# EAGLE schematic uOsc_2 board_2_v2.0 (EAGLE 9.2.1)

## Sheet 1 of 5
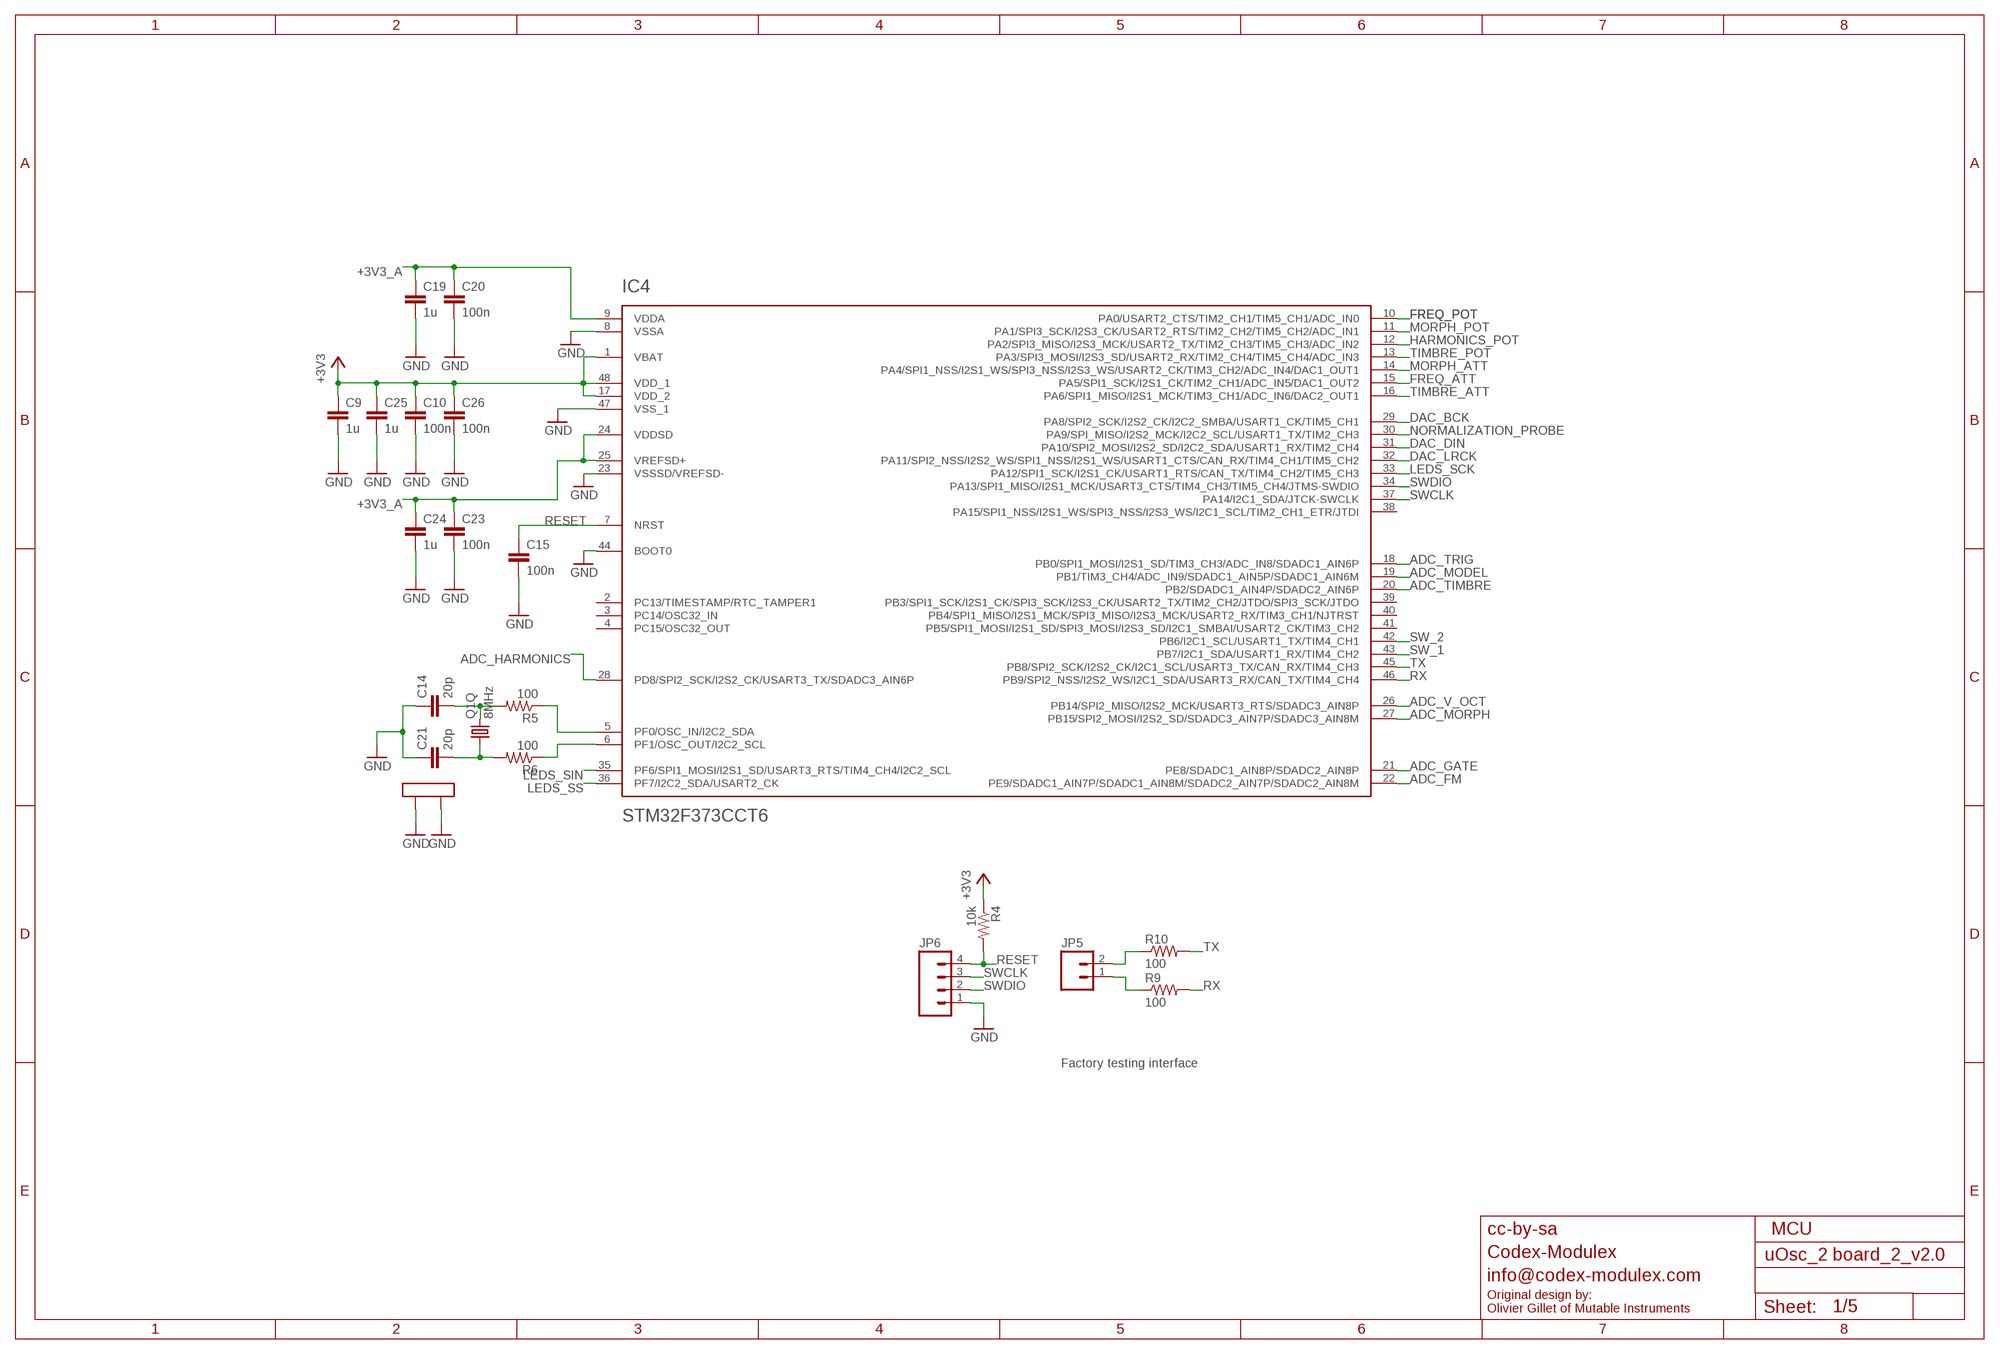
[diagram p0: schematic, sheet 1]

### Parts
C9  1u  PARTS_AMAN_CAPACITOR  [PARTS_AMAN_RESISTOR_0603]
C10  100n  PARTS_AMAN_CAPACITOR  [PARTS_AMAN_RESISTOR_0603]
C14  20p  PARTS_AMAN_CAPACITOR  [PARTS_AMAN_RESISTOR_0603]
C15  100n  PARTS_AMAN_CAPACITOR  [PARTS_AMAN_RESISTOR_0603]
C19  1u  PARTS_AMAN_CAPACITOR  [PARTS_AMAN_RESISTOR_0603]
C20  100n  PARTS_AMAN_CAPACITOR  [PARTS_AMAN_RESISTOR_0603]
C21  20p  PARTS_AMAN_CAPACITOR  [PARTS_AMAN_RESISTOR_0603]
C23  100n  PARTS_AMAN_CAPACITOR  [PARTS_AMAN_RESISTOR_0603]
C24  1u  PARTS_AMAN_CAPACITOR  [PARTS_AMAN_RESISTOR_0603]
C25  1u  PARTS_AMAN_CAPACITOR  [PARTS_AMAN_RESISTOR_0603]
C26  100n  PARTS_AMAN_CAPACITOR  [PARTS_AMAN_RESISTOR_0603]
IC4  STM32F373CCT6  STM32F373C  [LQFP48]
JP5  M02PTH  [1X02]
JP6  M04PTH  [1X04]
Q1  8MHz  CRYSTAL  [CTS406]
R4  10k  PARTS_AMAN_RESISTOR  [PARTS_AMAN_RESISTOR_0603]
R5  100  PARTS_AMAN_RESISTOR  [PARTS_AMAN_RESISTOR_0603]
R6  100  PARTS_AMAN_RESISTOR  [PARTS_AMAN_RESISTOR_0603]
R9  100  PARTS_AMAN_RESISTOR  [PARTS_AMAN_RESISTOR_0603]
R10  100  PARTS_AMAN_RESISTOR  [PARTS_AMAN_RESISTOR_0603]

### Nets
+3V3: C9.1 C10.1 C25.1 C26.1 IC4.1(VBAT) IC4.17(VDD_2) IC4.48(VDD_1) R4.1 ; also sheet 2,3,4,5
+3V3_A: C19.1 C20.1 C23.1 C24.1 IC4.9(VDDA) IC4.24(VDDSD) IC4.25(VREFSD+) ; also sheet 2,3,4,5
ADC_FM: IC4.22(PE9/SDADC1_AIN7P/SDADC1_AIN8M/SDADC2_AIN7P/SDADC2_AIN8M) ; also sheet 3
ADC_GATE: IC4.21(PE8/SDADC1_AIN8P/SDADC2_AIN8P) ; also sheet 3
ADC_HARMONICS: IC4.28(PD8/SPI2_SCK/I2S2_CK/USART3_TX/SDADC3_AIN6P) ; also sheet 3
ADC_MODEL: IC4.19(PB1/TIM3_CH4/ADC_IN9/SDADC1_AIN5P/SDADC1_AIN6M) ; also sheet 3
ADC_MORPH: IC4.27(PB15/SPI2_MOSI/I2S2_SD/SDADC3_AIN7P/SDADC3_AIN8M) ; also sheet 3
ADC_TIMBRE: IC4.20(PB2/SDADC1_AIN4P/SDADC2_AIN6P) ; also sheet 3
ADC_TRIG: IC4.18(PB0/SPI1_MOSI/I2S1_SD/TIM3_CH3/ADC_IN8/SDADC1_AIN6P) ; also sheet 3
ADC_V_OCT: IC4.26(PB14/SPI2_MISO/I2S2_MCK/USART3_RTS/SDADC3_AIN8P) ; also sheet 3
DAC_BCK: IC4.29(PA8/SPI2_SCK/I2S2_CK/I2C2_SMBA/USART1_CK/TIM5_CH1) ; also sheet 4
DAC_DIN: IC4.31(PA10/SPI2_MOSI/I2S2_SD/I2C2_SDA/USART1_RX/TIM2_CH4) ; also sheet 4
DAC_LRCK: IC4.32(PA11/SPI2_NSS/I2S2_WS/SPI1_NSS/I2S1_WS/USART1_CTS/CAN_RX/TIM4_CH1/TIM5_CH2) ; also sheet 4
FREQ_ATT: IC4.15(PA5/SPI1_SCK/I2S1_CK/TIM2_CH1/ADC_IN5/DAC1_OUT2) ; also sheet 2
FREQ_POT: IC4.10(PA0/USART2_CTS/TIM2_CH1/TIM5_CH1/ADC_IN0) ; also sheet 2
GND: C9.2 C10.2 C14.1 C15.2 C19.2 C20.2 C21.1 C23.2 C24.2 C25.2 C26.2 IC4.8(VSSA) IC4.23(VSSSD/VREFSD-) IC4.44(BOOT0) IC4.47(VSS_1) JP6.1 Q1.2(LID1) Q1.4(LID2) ; also sheet 2,3,4,5
HARMONICS_POT: IC4.12(PA2/SPI3_MISO/I2S3_MCK/USART2_TX/TIM2_CH3/TIM5_CH3/ADC_IN2) ; also sheet 2
LEDS_SCK: IC4.33(PA12/SPI1_SCK/I2S1_CK/USART1_RTS/CAN_TX/TIM4_CH2/TIM5_CH3) ; also sheet 2
LEDS_SIN: IC4.35(PF6/SPI1_MOSI/I2S1_SD/USART3_RTS/TIM4_CH4/I2C2_SCL) ; also sheet 2
LEDS_SS: IC4.36(PF7/I2C2_SDA/USART2_CK) ; also sheet 2
MORPH_ATT: IC4.14(PA4/SPI1_NSS/I2S1_WS/SPI3_NSS/I2S3_WS/USART2_CK/TIM3_CH2/ADC_IN4/DAC1_OUT1) ; also sheet 2
MORPH_POT: IC4.11(PA1/SPI3_SCK/I2S3_CK/USART2_RTS/TIM2_CH2/TIM5_CH2/ADC_IN1) ; also sheet 2
N$7: IC4.5(PF0/OSC_IN/I2C2_SDA) R5.1
N$8: IC4.6(PF1/OSC_OUT/I2C2_SCL) R6.1
N$29: C14.2 Q1.3 R5.2
N$33: JP5.2 R10.1
N$35: C21.2 Q1.1 R6.2
N$51: JP5.1 R9.1
NORMALIZATION_PROBE: IC4.30(PA9/SPI_MISO/I2S2_MCK/I2C2_SCL/USART1_TX/TIM2_CH3) ; also sheet 3
RESET: C15.1 IC4.7(NRST) JP6.4 R4.2
RX: IC4.46(PB9/SPI2_NSS/I2S2_WS/I2C1_SDA/USART3_RX/CAN_TX/TIM4_CH4) R9.2
SW_1: IC4.43(PB7/I2C1_SDA/USART1_RX/TIM4_CH2) ; also sheet 2
SW_2: IC4.42(PB6/I2C1_SCL/USART1_TX/TIM4_CH1) ; also sheet 2
SWCLK: IC4.37(PA14/I2C1_SDA/JTCK-SWCLK) JP6.3
SWDIO: IC4.34(PA13/SPI1_MISO/I2S1_MCK/USART3_CTS/TIM4_CH3/TIM5_CH4/JTMS-SWDIO) JP6.2
TIMBRE_ATT: IC4.16(PA6/SPI1_MISO/I2S1_MCK/TIM3_CH1/ADC_IN6/DAC2_OUT1) ; also sheet 2
TIMBRE_POT: IC4.13(PA3/SPI3_MOSI/I2S3_SD/USART2_RX/TIM2_CH4/TIM5_CH4/ADC_IN3) ; also sheet 2
TX: IC4.45(PB8/SPI2_SCK/I2S2_CK/I2C1_SCL/USART3_TX/CAN_RX/TIM4_CH3) R10.2
Unconnected: IC4.2(PC13/TIMESTAMP/RTC_TAMPER1) IC4.3(PC14/OSC32_IN) IC4.4(PC15/OSC32_OUT) IC4.38(PA15/SPI1_NSS/I2S1_WS/SPI3_NSS/I2S3_WS/I2C1_SCL/TIM2_CH1_ETR/JTDI) IC4.39(PB3/SPI1_SCK/I2S1_CK/SPI3_SCK/I2S3_CK/USART2_TX/TIM2_CH2/JTDO/SPI3_SCK/JTDO) IC4.40(PB4/SPI1_MISO/I2S1_MCK/SPI3_MISO/I2S3_MCK/USART2_RX/TIM3_CH1/NJTRST) IC4.41(PB5/SPI1_MOSI/I2S1_SD/SPI3_MOSI/I2S3_SD/I2C1_SMBAI/USART2_CK/TIM3_CH2)

### Notes on the sheet
- Factory testing interface
- cc-by-sa | MCU
- Codex-Modulex
- info@codex-modulex.com
- Original design by:
  Olivier Gillet of Mutable Instruments

## Sheet 2 of 5
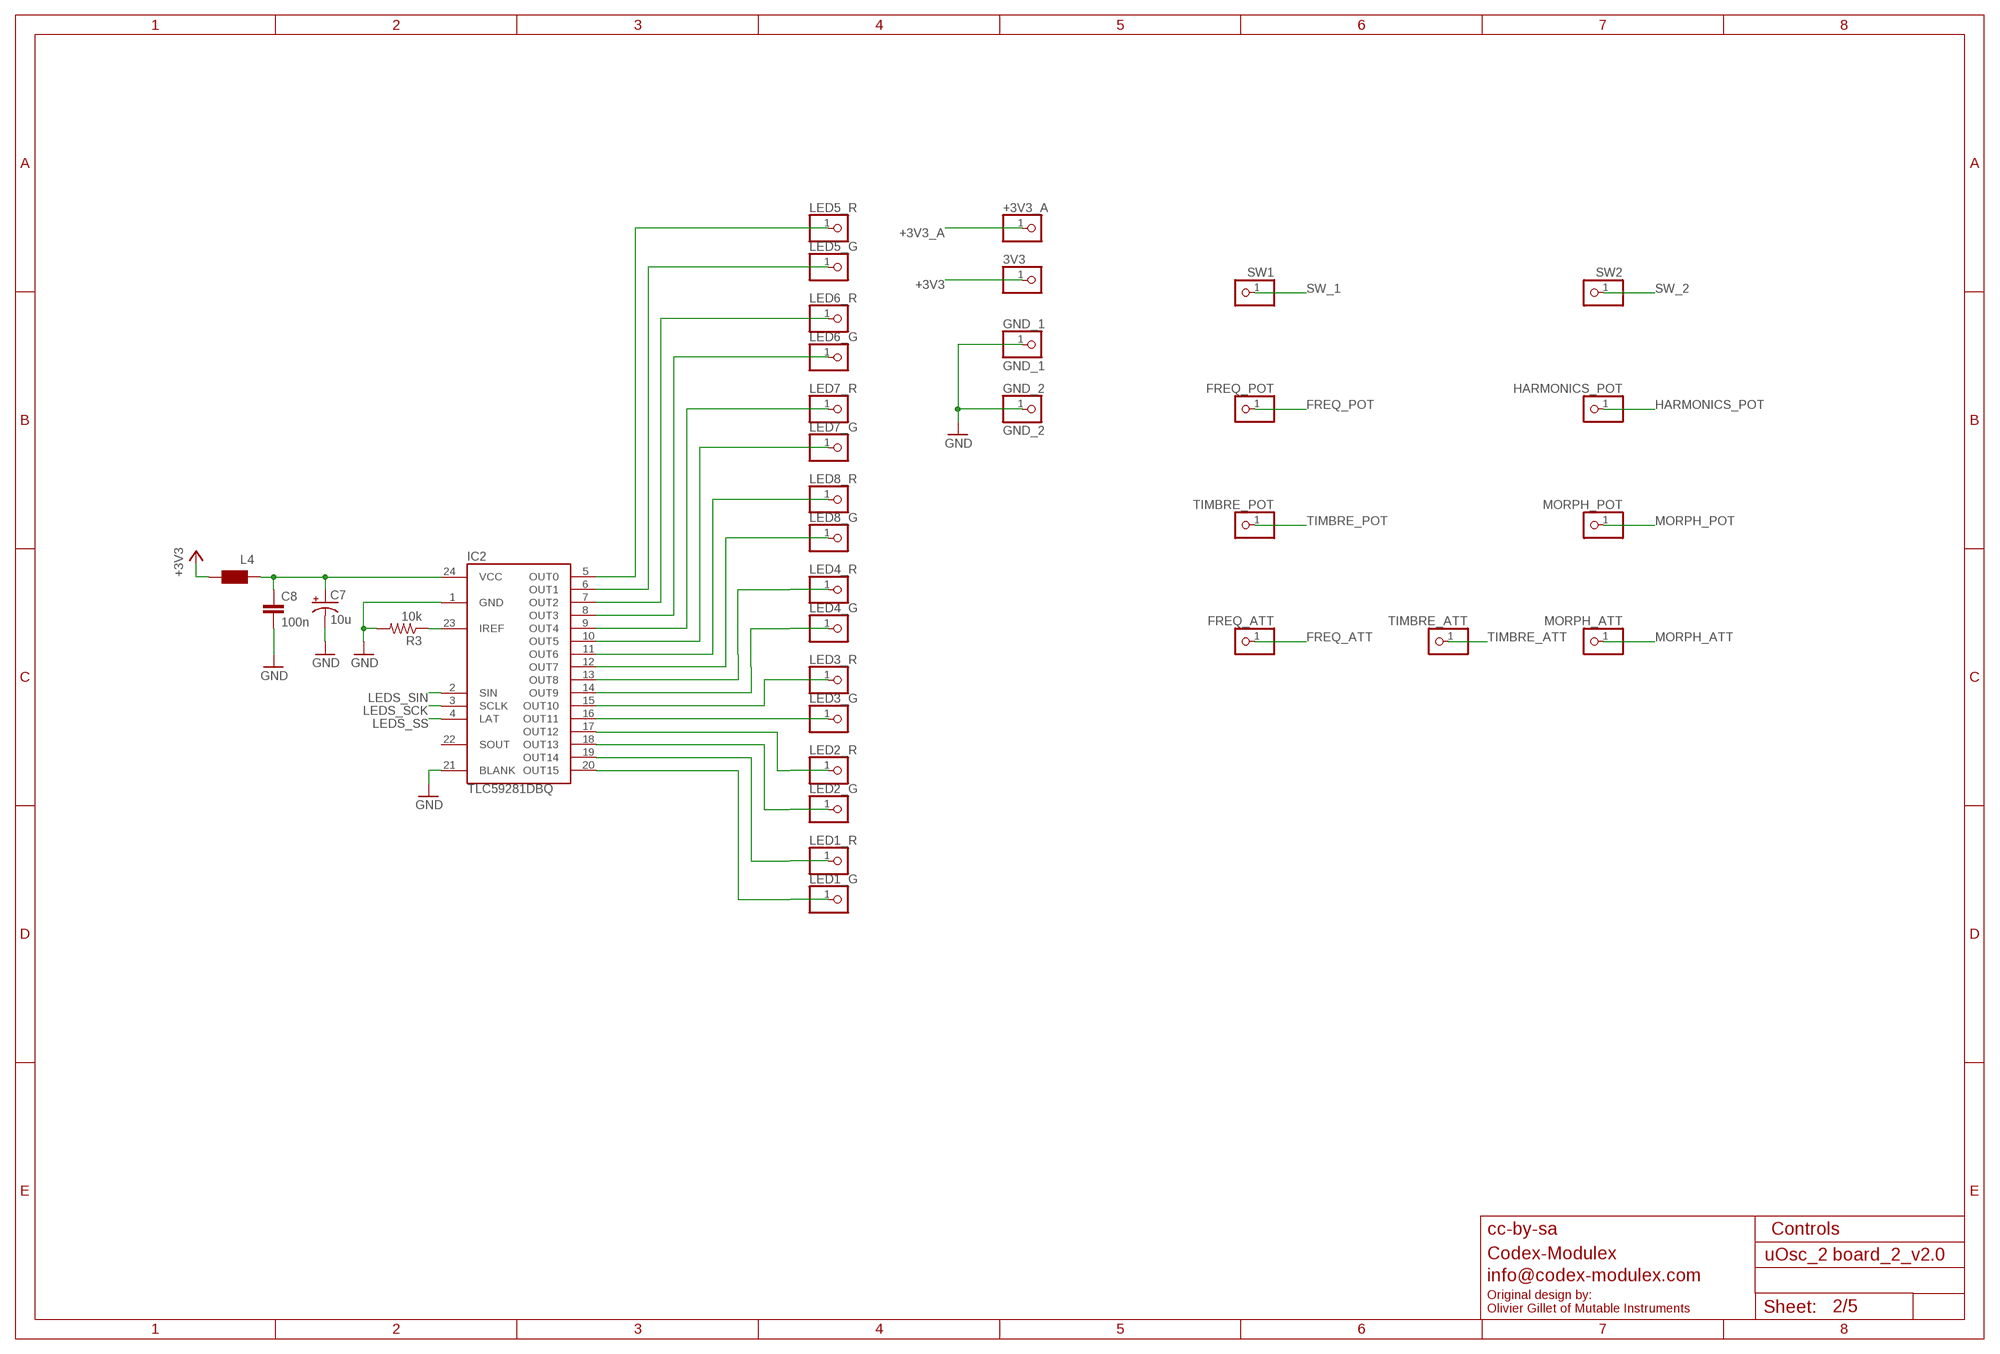
[diagram p1: schematic, sheet 2]

### Parts
3V3  PARTS_AMAN_PINHD-1X1  [PARTS_AMAN_1X01]
+3V3_A  PARTS_AMAN_PINHD-1X1  [PARTS_AMAN_1X01]
C7  10u  CPOL-USA  [PANASONIC_A]
C8  100n  PARTS_AMAN_CAPACITOR  [PARTS_AMAN_RESISTOR_0603]
FREQ_ATT  PARTS_AMAN_PINHD-1X1  [PARTS_AMAN_1X01]
FREQ_POT  PARTS_AMAN_PINHD-1X1  [PARTS_AMAN_1X01]
GND_1  GND_1  PARTS_AMAN_PINHD-1X1  [PARTS_AMAN_1X01]
GND_2  GND_2  PARTS_AMAN_PINHD-1X1  [PARTS_AMAN_1X01]
HARMONICS_POT  PARTS_AMAN_PINHD-1X1  [PARTS_AMAN_1X01]
IC2  TLC59281DBQ  [TSSOP24_0635]
L4  WE-CBF_0603  [0603]
LED1_G  PARTS_AMAN_PINHD-1X1  [PARTS_AMAN_1X01]
LED1_R  PARTS_AMAN_PINHD-1X1  [PARTS_AMAN_1X01]
LED2_G  PARTS_AMAN_PINHD-1X1  [PARTS_AMAN_1X01]
LED2_R  PARTS_AMAN_PINHD-1X1  [PARTS_AMAN_1X01]
LED3_G  PARTS_AMAN_PINHD-1X1  [PARTS_AMAN_1X01]
LED3_R  PARTS_AMAN_PINHD-1X1  [PARTS_AMAN_1X01]
LED4_G  PARTS_AMAN_PINHD-1X1  [PARTS_AMAN_1X01]
LED4_R  PARTS_AMAN_PINHD-1X1  [PARTS_AMAN_1X01]
LED5_G  PARTS_AMAN_PINHD-1X1  [PARTS_AMAN_1X01]
LED5_R  PARTS_AMAN_PINHD-1X1  [PARTS_AMAN_1X01]
LED6_G  PARTS_AMAN_PINHD-1X1  [PARTS_AMAN_1X01]
LED6_R  PARTS_AMAN_PINHD-1X1  [PARTS_AMAN_1X01]
LED7_G  PARTS_AMAN_PINHD-1X1  [PARTS_AMAN_1X01]
LED7_R  PARTS_AMAN_PINHD-1X1  [PARTS_AMAN_1X01]
LED8_G  PARTS_AMAN_PINHD-1X1  [PARTS_AMAN_1X01]
LED8_R  PARTS_AMAN_PINHD-1X1  [PARTS_AMAN_1X01]
MORPH_ATT  PARTS_AMAN_PINHD-1X1  [PARTS_AMAN_1X01]
MORPH_POT  PARTS_AMAN_PINHD-1X1  [PARTS_AMAN_1X01]
R3  10k  PARTS_AMAN_RESISTOR  [PARTS_AMAN_RESISTOR_0603]
SW1  PARTS_AMAN_PINHD-1X1  [PARTS_AMAN_1X01]
SW2  PARTS_AMAN_PINHD-1X1  [PARTS_AMAN_1X01]
TIMBRE_ATT  PARTS_AMAN_PINHD-1X1  [PARTS_AMAN_1X01]
TIMBRE_POT  PARTS_AMAN_PINHD-1X1  [PARTS_AMAN_1X01]

### Nets
+3V3: 3V3.1 L4.2 ; also sheet 1,3,4,5
+3V3_A: +3V3_A.1 ; also sheet 1,3,4,5
FREQ_ATT: FREQ_ATT.1 ; also sheet 1
FREQ_POT: FREQ_POT.1 ; also sheet 1
GND: C7.- C8.2 GND_1.1 GND_2.1 IC2.1(GND) IC2.21(BLANK) R3.2 ; also sheet 1,3,4,5
HARMONICS_POT: HARMONICS_POT.1 ; also sheet 1
LEDS_SCK: IC2.3(SCLK) ; also sheet 1
LEDS_SIN: IC2.2(SIN) ; also sheet 1
LEDS_SS: IC2.4(LAT) ; also sheet 1
MORPH_ATT: MORPH_ATT.1 ; also sheet 1
MORPH_POT: MORPH_POT.1 ; also sheet 1
N$2: IC2.12(OUT7) LED8_G.1
N$5: IC2.11(OUT6) LED8_R.1
N$9: IC2.10(OUT5) LED7_G.1
N$10: IC2.9(OUT4) LED7_R.1
N$11: IC2.8(OUT3) LED6_G.1
N$12: IC2.13(OUT8) LED4_R.1
N$13: IC2.7(OUT2) LED6_R.1
N$14: IC2.14(OUT9) LED4_G.1
N$15: IC2.6(OUT1) LED5_G.1
N$17: IC2.15(OUT10) LED3_R.1
N$18: IC2.16(OUT11) LED3_G.1
N$19: IC2.17(OUT12) LED2_R.1
N$20: IC2.18(OUT13) LED2_G.1
N$21: IC2.19(OUT14) LED1_R.1
N$22: IC2.5(OUT0) LED5_R.1
N$23: IC2.20(OUT15) LED1_G.1
N$27: C7.+ C8.1 IC2.24(VCC) L4.1
N$68: IC2.23(IREF) R3.1
SW_1: SW1.1 ; also sheet 1
SW_2: SW2.1 ; also sheet 1
TIMBRE_ATT: TIMBRE_ATT.1 ; also sheet 1
TIMBRE_POT: TIMBRE_POT.1 ; also sheet 1
Unconnected: IC2.22(SOUT)

### Notes on the sheet
- cc-by-sa | Controls
- Codex-Modulex
- info@codex-modulex.com
- Original design by:
  Olivier Gillet of Mutable Instruments

## Sheet 3 of 5
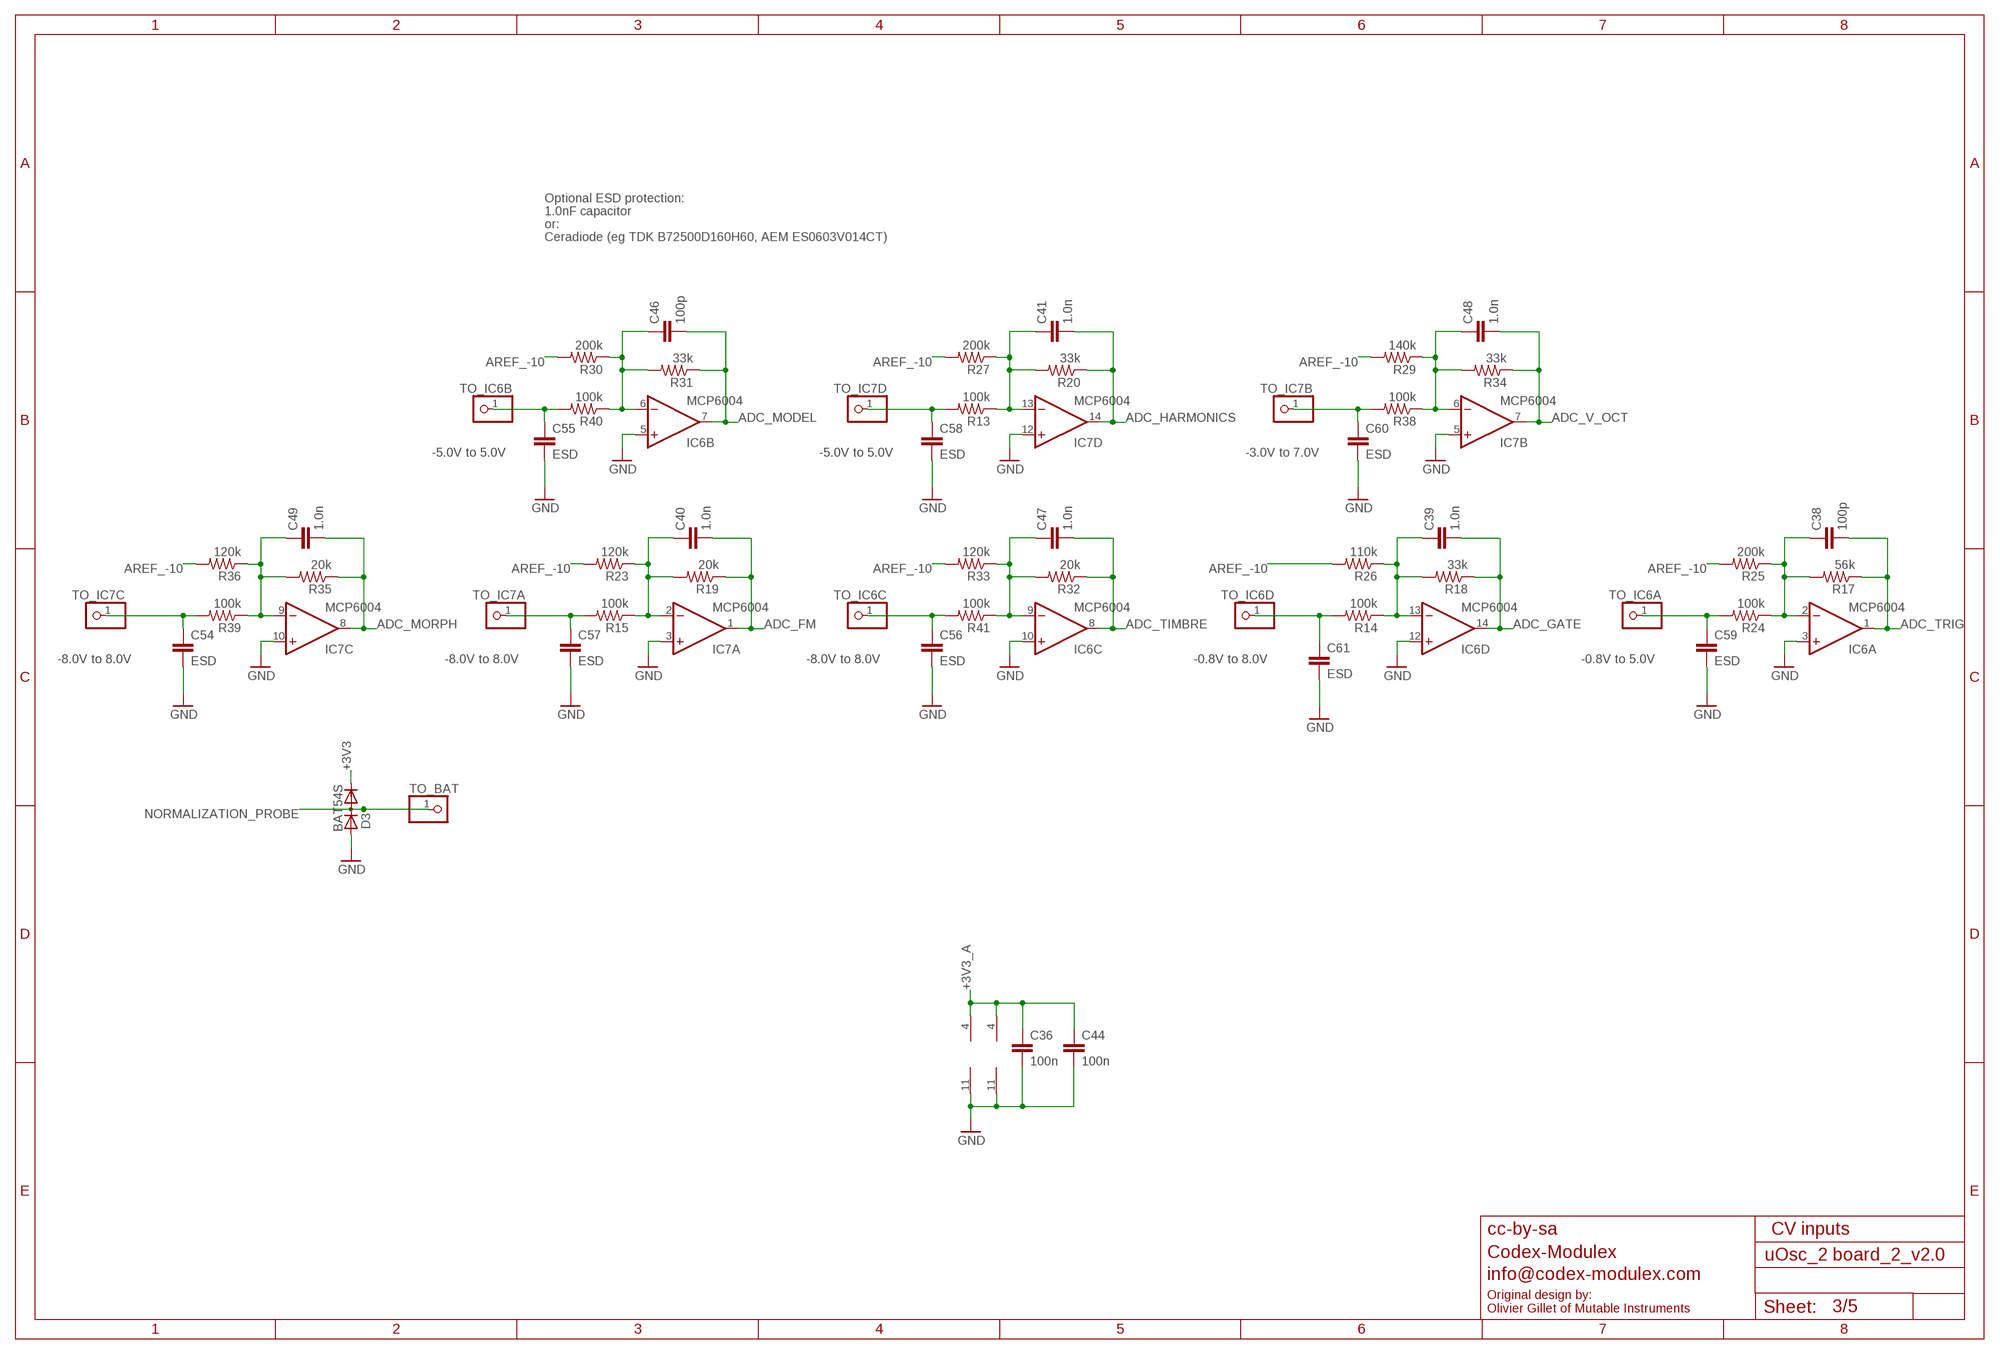
[diagram p2: schematic, sheet 3]

### Parts
C36  100n  PARTS_AMAN_CAPACITOR  [PARTS_AMAN_RESISTOR_0603]
C38  100p  PARTS_AMAN_CAPACITOR  [PARTS_AMAN_RESISTOR_0603]
C39  1.0n  PARTS_AMAN_CAPACITOR  [PARTS_AMAN_RESISTOR_0603]
C40  1.0n  PARTS_AMAN_CAPACITOR  [PARTS_AMAN_RESISTOR_0603]
C41  1.0n  PARTS_AMAN_CAPACITOR  [PARTS_AMAN_RESISTOR_0603]
C44  100n  PARTS_AMAN_CAPACITOR  [PARTS_AMAN_RESISTOR_0603]
C46  100p  PARTS_AMAN_CAPACITOR  [PARTS_AMAN_RESISTOR_0603]
C47  1.0n  PARTS_AMAN_CAPACITOR  [PARTS_AMAN_RESISTOR_0603]
C48  1.0n  PARTS_AMAN_CAPACITOR  [PARTS_AMAN_RESISTOR_0603]
C49  1.0n  PARTS_AMAN_CAPACITOR  [PARTS_AMAN_RESISTOR_0603]
C54  ESD  PARTS_AMAN_CAPACITOR  [PARTS_AMAN_RESISTOR_0603]
C55  ESD  PARTS_AMAN_CAPACITOR  [PARTS_AMAN_RESISTOR_0603]
C56  ESD  PARTS_AMAN_CAPACITOR  [PARTS_AMAN_RESISTOR_0603]
C57  ESD  PARTS_AMAN_CAPACITOR  [PARTS_AMAN_RESISTOR_0603]
C58  ESD  PARTS_AMAN_CAPACITOR  [PARTS_AMAN_RESISTOR_0603]
C59  ESD  PARTS_AMAN_CAPACITOR  [PARTS_AMAN_RESISTOR_0603]
C60  ESD  PARTS_AMAN_CAPACITOR  [PARTS_AMAN_RESISTOR_0603]
C61  ESD  PARTS_AMAN_CAPACITOR  [PARTS_AMAN_RESISTOR_0603]
D3  BAT54S  DIODE_2CACA-SOT23  [SOT23]
IC6  MCP6004  TL074PW  [TSSOP14_065]
IC7  MCP6004  TL074PW  [TSSOP14_065]
R13  100k  PARTS_AMAN_RESISTOR  [PARTS_AMAN_RESISTOR_0603]
R14  100k  PARTS_AMAN_RESISTOR  [PARTS_AMAN_RESISTOR_0603]
R15  100k  PARTS_AMAN_RESISTOR  [PARTS_AMAN_RESISTOR_0603]
R17  56k  PARTS_AMAN_RESISTOR  [PARTS_AMAN_RESISTOR_0603]
R18  33k  PARTS_AMAN_RESISTOR  [PARTS_AMAN_RESISTOR_0603]
R19  20k  PARTS_AMAN_RESISTOR  [PARTS_AMAN_RESISTOR_0603]
R20  33k  PARTS_AMAN_RESISTOR  [PARTS_AMAN_RESISTOR_0603]
R23  120k  PARTS_AMAN_RESISTOR  [PARTS_AMAN_RESISTOR_0603]
R24  100k  PARTS_AMAN_RESISTOR  [PARTS_AMAN_RESISTOR_0603]
R25  200k  PARTS_AMAN_RESISTOR  [PARTS_AMAN_RESISTOR_0603]
R26  110k  PARTS_AMAN_RESISTOR  [PARTS_AMAN_RESISTOR_0603]
R27  200k  PARTS_AMAN_RESISTOR  [PARTS_AMAN_RESISTOR_0603]
R29  140k  PARTS_AMAN_RESISTOR  [PARTS_AMAN_RESISTOR_0603]
R30  200k  PARTS_AMAN_RESISTOR  [PARTS_AMAN_RESISTOR_0603]
R31  33k  PARTS_AMAN_RESISTOR  [PARTS_AMAN_RESISTOR_0603]
R32  20k  PARTS_AMAN_RESISTOR  [PARTS_AMAN_RESISTOR_0603]
R33  120k  PARTS_AMAN_RESISTOR  [PARTS_AMAN_RESISTOR_0603]
R34  33k  PARTS_AMAN_RESISTOR  [PARTS_AMAN_RESISTOR_0603]
R35  20k  PARTS_AMAN_RESISTOR  [PARTS_AMAN_RESISTOR_0603]
R36  120k  PARTS_AMAN_RESISTOR  [PARTS_AMAN_RESISTOR_0603]
R38  100k  PARTS_AMAN_RESISTOR  [PARTS_AMAN_RESISTOR_0603]
R39  100k  PARTS_AMAN_RESISTOR  [PARTS_AMAN_RESISTOR_0603]
R40  100k  PARTS_AMAN_RESISTOR  [PARTS_AMAN_RESISTOR_0603]
R41  100k  PARTS_AMAN_RESISTOR  [PARTS_AMAN_RESISTOR_0603]
TO_BAT  PARTS_AMAN_PINHD-1X1  [PARTS_AMAN_1X01]
TO_IC6A  PARTS_AMAN_PINHD-1X1  [PARTS_AMAN_1X01]
TO_IC6B  PARTS_AMAN_PINHD-1X1  [PARTS_AMAN_1X01]
TO_IC6C  PARTS_AMAN_PINHD-1X1  [PARTS_AMAN_1X01]
TO_IC6D  PARTS_AMAN_PINHD-1X1  [PARTS_AMAN_1X01]
TO_IC7A  PARTS_AMAN_PINHD-1X1  [PARTS_AMAN_1X01]
TO_IC7B  PARTS_AMAN_PINHD-1X1  [PARTS_AMAN_1X01]
TO_IC7C  PARTS_AMAN_PINHD-1X1  [PARTS_AMAN_1X01]
TO_IC7D  PARTS_AMAN_PINHD-1X1  [PARTS_AMAN_1X01]

### Nets
+3V3: D3.2(C) ; also sheet 1,2,4,5
+3V3_A: C36.1 C44.1 IC6.4(P:V+) IC7.4(P:V+) ; also sheet 1,2,4,5
ADC_FM: C40.2 IC7.1(A:OUT) R19.1 ; also sheet 1
ADC_GATE: C39.2 IC6.14(D:OUT) R18.1 ; also sheet 1
ADC_HARMONICS: C41.2 IC7.14(D:OUT) R20.1 ; also sheet 1
ADC_MODEL: C46.2 IC6.7(B:OUT) R31.1 ; also sheet 1
ADC_MORPH: C49.2 IC7.8(C:OUT) R35.1 ; also sheet 1
ADC_TIMBRE: C47.2 IC6.8(C:OUT) R32.1 ; also sheet 1
ADC_TRIG: C38.2 IC6.1(A:OUT) R17.1 ; also sheet 1
ADC_V_OCT: C48.2 IC7.7(B:OUT) R34.1 ; also sheet 1
AREF_-10: R23.2 R25.2 R26.2 R27.2 R29.2 R30.2 R33.2 R36.2 ; also sheet 5
FM_IN: C57.1 R15.2 TO_IC7A.1
GATE_IN: C61.1 R14.2 TO_IC6D.1
GATE_IN1: C59.1 R24.2 TO_IC6A.1
GND: C36.2 C44.2 C54.2 C55.2 C56.2 C57.2 C58.2 C59.2 C60.2 C61.2 D3.1(A) IC6.3(A:+IN) IC6.5(B:+IN) IC6.10(C:+IN) IC6.11(P:V-) IC6.12(D:+IN) IC7.3(A:+IN) IC7.5(B:+IN) IC7.10(C:+IN) IC7.11(P:V-) IC7.12(D:+IN) ; also sheet 1,2,4,5
HARMONICS_IN: C58.1 R13.2 TO_IC7D.1
MODEL_IN: C55.1 R40.2 TO_IC6B.1
MORPH_IN: C54.1 R39.2 TO_IC7C.1
N$4: C38.1 IC6.2(A:-IN) R17.2 R24.1 R25.1
N$28: C39.1 IC6.13(D:-IN) R14.1 R18.2 R26.1
N$30: C48.1 IC7.6(B:-IN) R29.1 R34.2 R38.1
N$31: C56.1 R41.2 TO_IC6C.1
N$32: C49.1 IC7.9(C:-IN) R35.2 R36.1 R39.1
N$34: C40.1 IC7.2(A:-IN) R15.1 R19.2 R23.1
N$37: C46.1 IC6.6(B:-IN) R30.1 R31.2 R40.1
N$39: C47.1 IC6.9(C:-IN) R32.2 R33.1 R41.1
N$41: C41.1 IC7.13(D:-IN) R13.1 R20.2 R27.1
NORMALIZATION_PROBE: D3.3(AC) TO_BAT.1 ; also sheet 1
V_OCT_IN: C60.1 R38.2 TO_IC7B.1

### Notes on the sheet
- Optional ESD protection:
- 1.0nF capacitor
- or:
- Ceradiode (eg TDK B72500D160H60, AEM ES0603V014CT)
- -5.0V to 5.0V | -5.0V to 5.0V | -3.0V to 7.0V
- -8.0V to 8.0V | -8.0V to 8.0V | -8.0V to 8.0V | -0.8V to 8.0V | -0.8V to 5.0V
- cc-by-sa | CV inputs
- Codex-Modulex
- info@codex-modulex.com
- Original design by:
  Olivier Gillet of Mutable Instruments

## Sheet 4 of 5
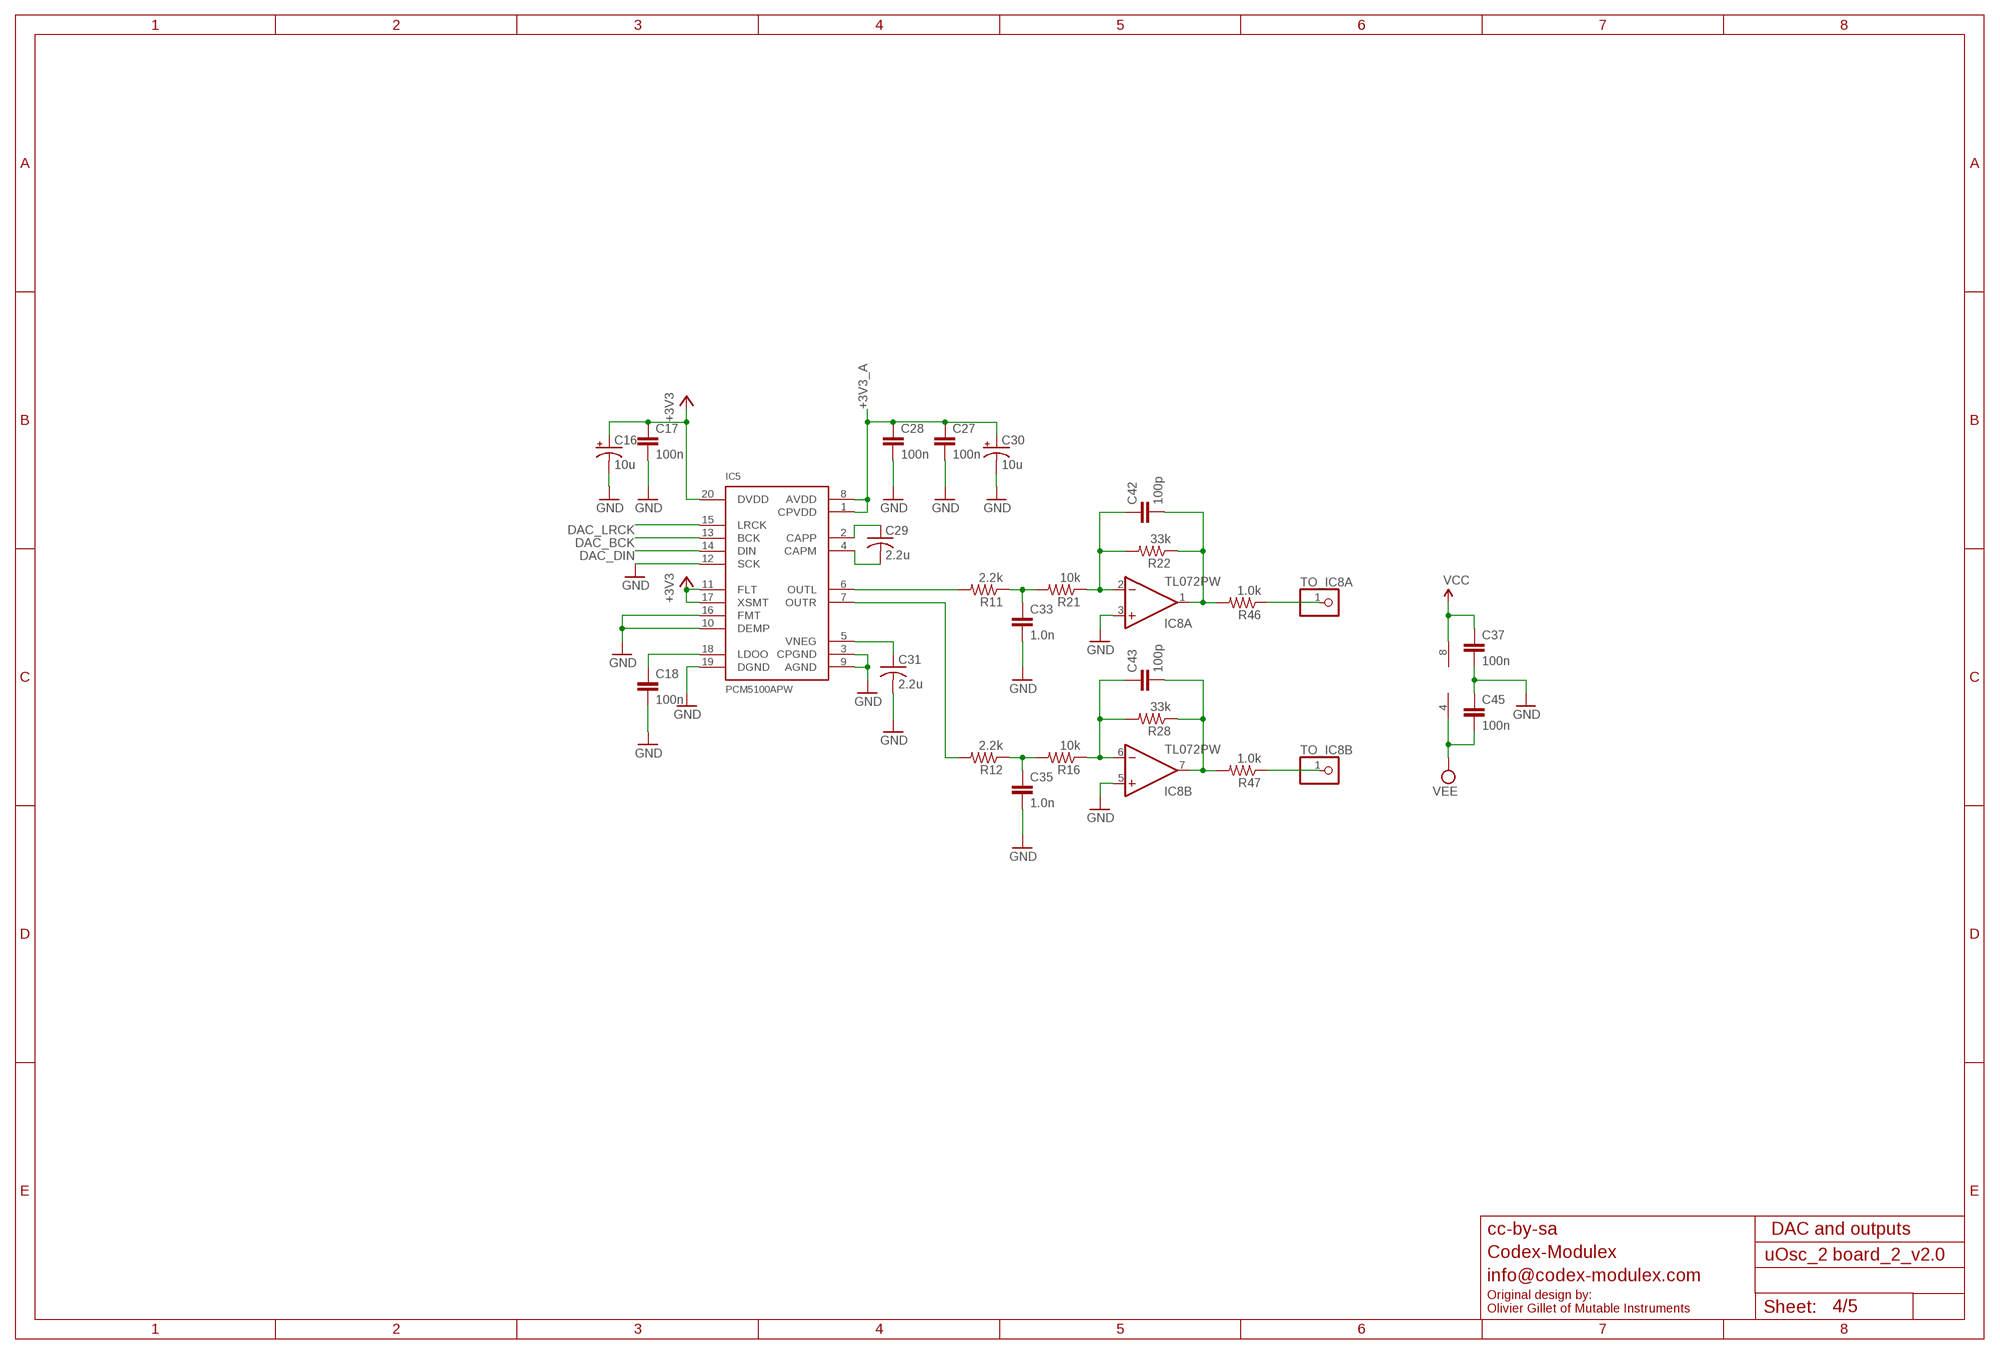
[diagram p3: schematic, sheet 4]

### Parts
C16  10u  CPOL-USA  [PANASONIC_A]
C17  100n  PARTS_AMAN_CAPACITOR  [PARTS_AMAN_RESISTOR_0603]
C18  100n  PARTS_AMAN_CAPACITOR  [PARTS_AMAN_RESISTOR_0603]
C27  100n  PARTS_AMAN_CAPACITOR  [PARTS_AMAN_RESISTOR_0603]
C28  100n  PARTS_AMAN_CAPACITOR  [PARTS_AMAN_RESISTOR_0603]
C29  2.2u  C-USC0805  [C0805]
C30  10u  CPOL-USA  [PANASONIC_A]
C31  2.2u  C-USC0805  [C0805]
C33  1.0n  PARTS_AMAN_CAPACITOR  [PARTS_AMAN_RESISTOR_0603]
C35  1.0n  PARTS_AMAN_CAPACITOR  [PARTS_AMAN_RESISTOR_0603]
C37  100n  PARTS_AMAN_CAPACITOR  [PARTS_AMAN_RESISTOR_0603]
C42  100p  PARTS_AMAN_CAPACITOR  [PARTS_AMAN_RESISTOR_0603]
C43  100p  PARTS_AMAN_CAPACITOR  [PARTS_AMAN_RESISTOR_0603]
C45  100n  PARTS_AMAN_CAPACITOR  [PARTS_AMAN_RESISTOR_0603]
IC5  PCM5100APW  PCM5100PW  [SSOP20]
IC8  TL072PW  [TSSOP08]
R11  2.2k  PARTS_AMAN_RESISTOR  [PARTS_AMAN_RESISTOR_0603]
R12  2.2k  PARTS_AMAN_RESISTOR  [PARTS_AMAN_RESISTOR_0603]
R16  10k  PARTS_AMAN_RESISTOR  [PARTS_AMAN_RESISTOR_0603]
R21  10k  PARTS_AMAN_RESISTOR  [PARTS_AMAN_RESISTOR_0603]
R22  33k  PARTS_AMAN_RESISTOR  [PARTS_AMAN_RESISTOR_0603]
R28  33k  PARTS_AMAN_RESISTOR  [PARTS_AMAN_RESISTOR_0603]
R46  1.0k  PARTS_AMAN_RESISTOR  [PARTS_AMAN_RESISTOR_0603]
R47  1.0k  PARTS_AMAN_RESISTOR  [PARTS_AMAN_RESISTOR_0603]
TO_IC8A  PARTS_AMAN_PINHD-1X1  [PARTS_AMAN_1X01]
TO_IC8B  PARTS_AMAN_PINHD-1X1  [PARTS_AMAN_1X01]

### Nets
+3V3: C16.+ C17.1 IC5.11(FLT) IC5.17(XSMT) IC5.20(DVDD) ; also sheet 1,2,3,5
+3V3_A: C27.1 C28.1 C30.+ IC5.1(CPVDD) IC5.8(AVDD) ; also sheet 1,2,3,5
DAC_BCK: IC5.13(BCK) ; also sheet 1
DAC_DIN: IC5.14(DIN) ; also sheet 1
DAC_LRCK: IC5.15(LRCK) ; also sheet 1
GND: C16.- C17.2 C18.2 C27.2 C28.2 C30.- C31.2 C33.2 C35.2 C37.2 C45.1 IC5.3(CPGND) IC5.9(AGND) IC5.10(DEMP) IC5.12(SCK) IC5.16(FMT) IC5.19(DGND) IC8.3(A:+IN) IC8.5(B:+IN) ; also sheet 1,2,3,5
N$6: C29.1 IC5.2(CAPP)
N$16: C29.2 IC5.4(CAPM)
N$43: IC5.6(OUTL) R11.2
N$46: C33.1 R11.1 R21.2
N$47: C35.1 R12.1 R16.2
N$48: C31.1 IC5.5(VNEG)
N$54: C18.1 IC5.18(LDOO)
N$55: IC5.7(OUTR) R12.2
N$58: C43.1 IC8.6(B:-IN) R16.1 R28.2
N$60: C43.2 IC8.7(B:OUT) R28.1 R47.2
N$62: C42.1 IC8.2(A:-IN) R21.1 R22.2
N$63: C42.2 IC8.1(A:OUT) R22.1 R46.2
N$65: R46.1 TO_IC8A.1
N$69: R47.1 TO_IC8B.1
VCC: C37.1 IC8.8(P:V+) ; also sheet 5
VEE: C45.2 IC8.4(P:V-) ; also sheet 5

### Notes on the sheet
- cc-by-sa | DAC and outputs
- Codex-Modulex
- info@codex-modulex.com
- Original design by:
  Olivier Gillet of Mutable Instruments

## Sheet 5 of 5
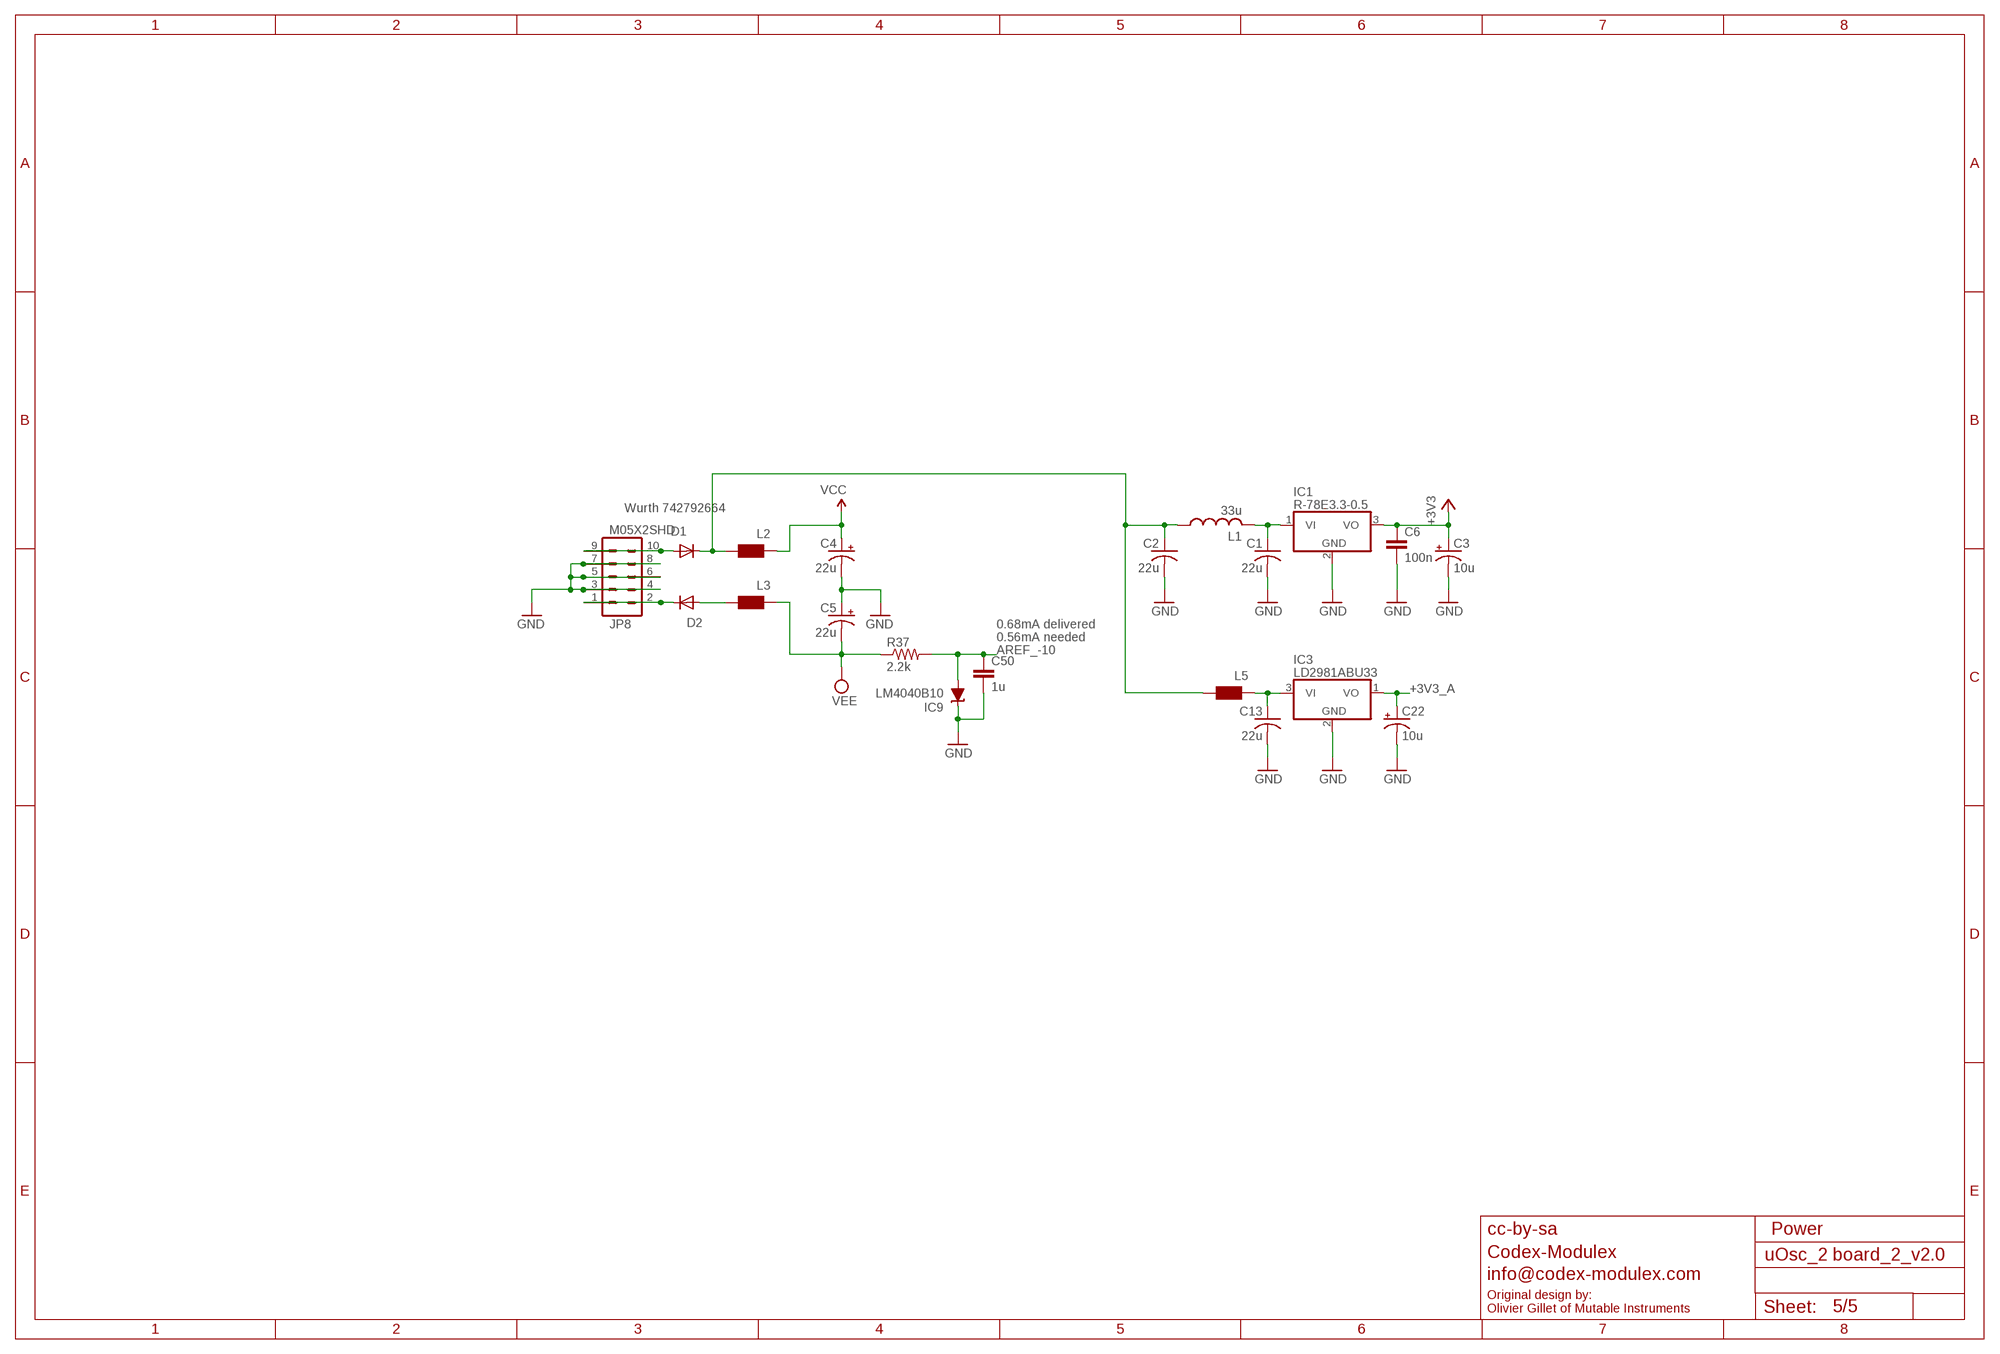
[diagram p4: schematic, sheet 5]

### Parts
C1  22u  C-USC1206  [C1206]
C2  22u  C-USC1206  [C1206]
C3  10u  CPOL-USA  [PANASONIC_A]
C4  22u  CPOL-USB  [PANASONIC_B]
C5  22u  CPOL-USB  [PANASONIC_B]
C6  100n  PARTS_AMAN_CAPACITOR  [PARTS_AMAN_RESISTOR_0603]
C13  22u  C-USC1206  [C1206]
C22  10u  CPOL-USA  [PANASONIC_A]
C50  1u  PARTS_AMAN_CAPACITOR  [PARTS_AMAN_RESISTOR_0603]
D1  1N5819HW  DIODE-SOD123  [SOD123]
D2  1N5819HW  DIODE-SOD123  [SOD123]
IC1  R-78E3.3-0.5  WE173950378  [WE78]
IC3  LD2981ABU33  LD2981ABU  [SOT89]
IC9  LM4040B10  LM4041B12DBZ  [DBZ_R-PDSO-G3]
JP8  M05X2SHD  [2X5-SHROUDED]
L1  33u  L-USL2012C  [L2012C]
L2  WE-CBF_0603  [0603]
L3  WE-CBF_0603  [0603]
L5  WE-CBF_0603  [0603]
R37  2.2k  PARTS_AMAN_RESISTOR  [PARTS_AMAN_RESISTOR_0603]

### Nets
+3V3: C3.+ C6.1 IC1.3(VO) ; also sheet 1,2,3,4
+3V3_A: C22.+ IC3.1(VO) ; also sheet 1,2,3,4
AREF_-10: C50.1 IC9.2(A) R37.2 ; also sheet 3
GND: C1.2 C2.2 C3.- C4.- C5.+ C6.2 C13.2 C22.- C50.2 IC1.2(GND) IC3.2(GND) IC9.1(C) JP8.3 JP8.4 JP8.5 JP8.6 JP8.7 JP8.8 ; also sheet 1,2,3,4
N$1: C1.1 IC1.1(VI) L1.2
N$38: D2.A L3.2
N$40: C2.1 D1.C L1.1 L2.2 L5.2
N$42: C13.1 IC3.3(VI) L5.1
N$56: D1.A JP8.9 JP8.10
N$64: D2.C JP8.1 JP8.2
VCC: C4.+ L2.1 ; also sheet 4
VEE: C5.- L3.1 R37.1 ; also sheet 4

### Notes on the sheet
- Wurth 742792664
- 0.68mA delivered
- 0.56mA needed
- cc-by-sa | Power
- Codex-Modulex
- info@codex-modulex.com
- Original design by:
  Olivier Gillet of Mutable Instruments

## Library data of the parts
3V3 +3V3_A FREQ_ATT FREQ_POT GND_1 GND_2 HARMONICS_POT LED1_G LED1_R LED2_G LED2_R LED3_G LED3_R LED4_G LED4_R LED5_G LED5_R LED6_G LED6_R LED7_G LED7_R LED8_G LED8_R MORPH_ATT MORPH_POT SW1 SW2 TIMBRE_ATT TIMBRE_POT TO_BAT TO_IC6A TO_IC6B TO_IC6C TO_IC6D TO_IC7A TO_IC7B TO_IC7C TO_IC7D TO_IC8A TO_IC8B = atom_v1_1_board_2:PARTS_AMAN_PINHD-1X1: PIN HEADER
C1 C2 C13 C29 C31 = rcl:C-US: CAPACITOR, American symbol
C3-C5 C7 C16 C22 C30 = rcl:CPOL-US: POLARIZED CAPACITOR, American symbol
C6 C8-C10 C14 C15 C17-C21 C23-C28 C33 C35-C50 C54-C61 = atom_v1_1_board_2:PARTS_AMAN_CAPACITOR
D1 D2 = diode:DIODE-: DIODE
D3 = diode:DIODE_2CACA-: 2 Diodes - Cathode-Anode|Cathode-Anode
IC1 = og-vreg:WE173950378
IC2 = og-ics:TLC59281
IC3 = og-vreg:LD2981
IC4 = og-stm32f2:STM32F373C
IC5 = og-dac:PCM5100
IC6 IC7 = og-linear:TL074: OP AMP
IC8 = og-linear:TL072: OP AMP
IC9 = texas:LM4041: PRECISION MICROPOWER SHUNT VOLTAGE REFERENCE Source: http://focus.ti.com/lit/ds/slcs146e/slcs146e.pdf
JP5 = SparkFun:M02: Header 2 Standard 2-pin 0.1" header. Use with straight break away headers (SKU : PRT-00116), right angle break away headers (PRT-00553), swiss pins (PRT-00743), machine pins (PRT-00117), and female headers (PRT-00115). Molex polarized connector foot print use with SKU : PRT-08233 with associated crimp pins and housings.
JP6 = SparkFun:M04: Header 4 Standard 4-pin 0.1" header. Use with straight break away headers (SKU : PRT-00116), right angle break away headers (PRT-00553), swiss pins (PRT-00743), machine pins (PRT-00117), and female headers (PRT-00115). Molex polarized connector foot print use with SKU : PRT-08231 with associated crimp pins and housings.
JP8 = og-header:M05X2: Header 5x2 Standard 10-pin dual row 0.1" header. Commonly used with AVR-ISP. Use with Spark Fun Electronics SKU: PRT-00778
L1 = og-rcl:L-US
L2-L5 = wuerth-elektronik:WE-CBF: SMD EMI Suppression Ferrite Beads - excellent anti-EMI properties - low DCR - impedances till 3000 ohms - rated current up to 6 A
Q1 = og-crystal:CRYSTAL: Crystal with 2 extra terminals for the metal LID (Abracon ABMM2 for example)
R3-R6 R9-R41 R46 R47 = atom_v1_1_board_2:PARTS_AMAN_RESISTOR